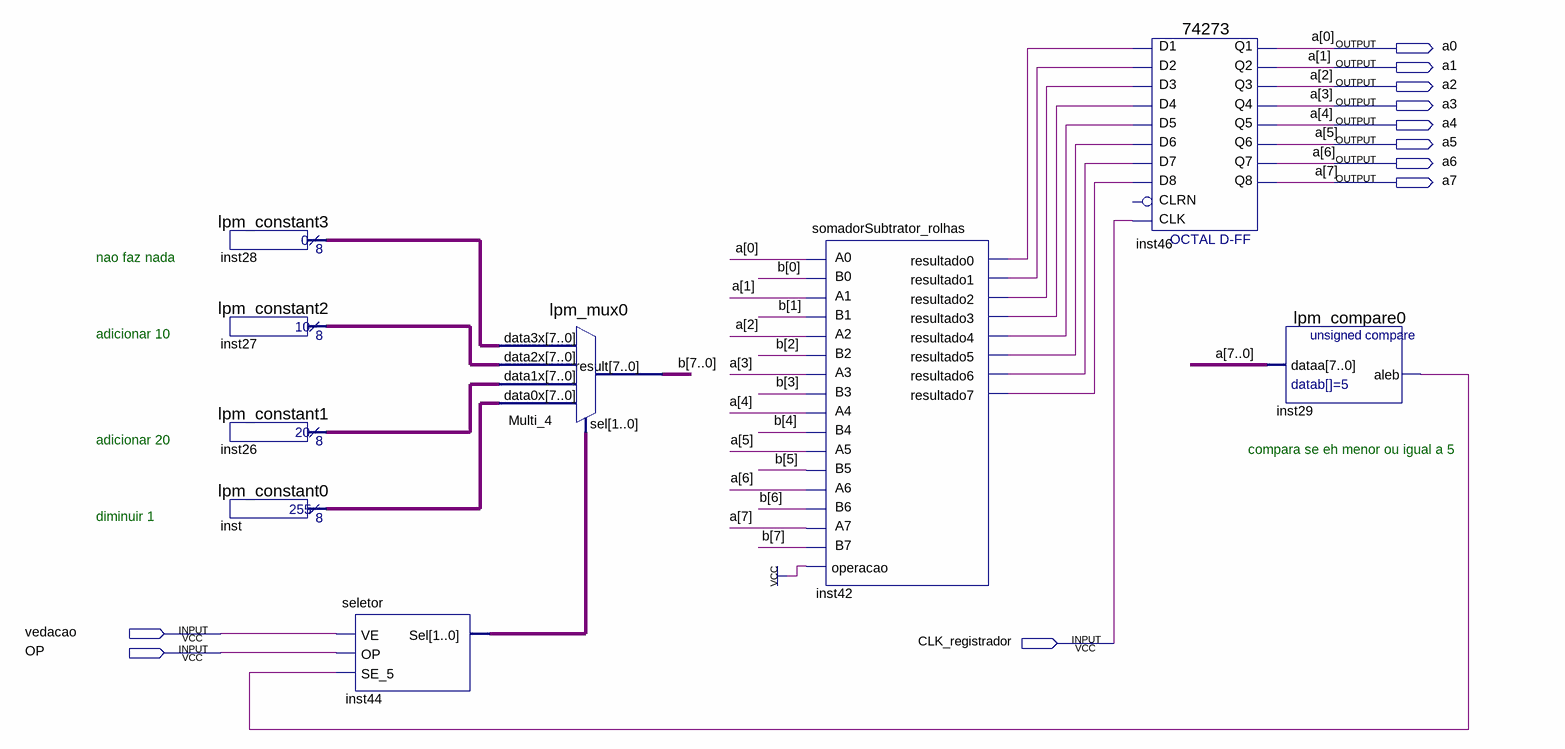
[diagram p0: schematic sheet]
// Quartus schematic contador_de_rolhas.bdf as structural Verilog: 9 symbols, 11 pins
module contador_de_rolhas (
  input  vedacao,
  input  CLK_registrador,
  input  OP,
  output a0,
  output a1,
  output a2,
  output a3,
  output a4,
  output a5,
  output a6,
  output a7
);

  wire inst29_aleb, inst42_resultado0, inst42_resultado1, inst42_resultado2, inst42_resultado3,
       inst42_resultado4, inst42_resultado5, inst42_resultado6, inst42_resultado7;
  wire [1:0] inst44_sel;
  wire [7:0] b, inst26_result, inst27_result, inst28_result, inst_result;

  lpm_constant3 inst28 (.result(inst28_result));
  lpm_constant2 inst27 (.result(inst27_result));
  lpm_constant1 inst26 (.result(inst26_result));
  lpm_constant0 inst (.result(inst_result));
  seletor inst44 (.VE(vedacao), .OP(OP), .SE_5(inst29_aleb), .Sel(inst44_sel));
  lpm_mux0 Multi_4 (
    .data3x(inst28_result), .data2x(inst27_result), .data1x(inst26_result), .data0x(inst_result),
    .sel(inst44_sel), .result(b));
  somadorSubtrator_rolhas inst42 (
    .B3(a0), .A3(b[0]), .B2(a1), .A2(b[1]), .B1(a2), .A1(b[2]), .B0(a3), .A0(b[3]), .B4(a4), .A4(b[4]),
    .B5(a5), .A5(b[5]), .B6(a6), .A6(b[6]), .B7(a7), .A7(b[7]), .operacao(1'b1),
    .resultado0(inst42_resultado0), .resultado1(inst42_resultado1), .resultado2(inst42_resultado2),
    .resultado3(inst42_resultado3), .resultado4(inst42_resultado4), .resultado5(inst42_resultado5),
    .resultado6(inst42_resultado6), .resultado7(inst42_resultado7));
  \74273  inst46 (
    .D2(inst42_resultado1), .D3(inst42_resultado2), .D1(inst42_resultado0), .D4(inst42_resultado3),
    .D7(inst42_resultado6), .D6(inst42_resultado5), .D5(inst42_resultado4), .D8(inst42_resultado7),
    .CLK(CLK_registrador), .Q4(a3), .Q1(a0), .Q2(a1), .Q3(a2), .Q6(a5), .Q5(a4), .Q7(a6), .Q8(a7));  // open: CLRN
  lpm_compare0 inst29 (.dataa({a7, a6, a5, a4, a3, a2, a1, a0}), .aleb(inst29_aleb));

  // Notes on the sheet:
  //   nao faz nada
  //   adicionar 10
  //   adicionar 20
  //   compara se eh menor ou igual a 5
  //   diminuir 1
endmodule
